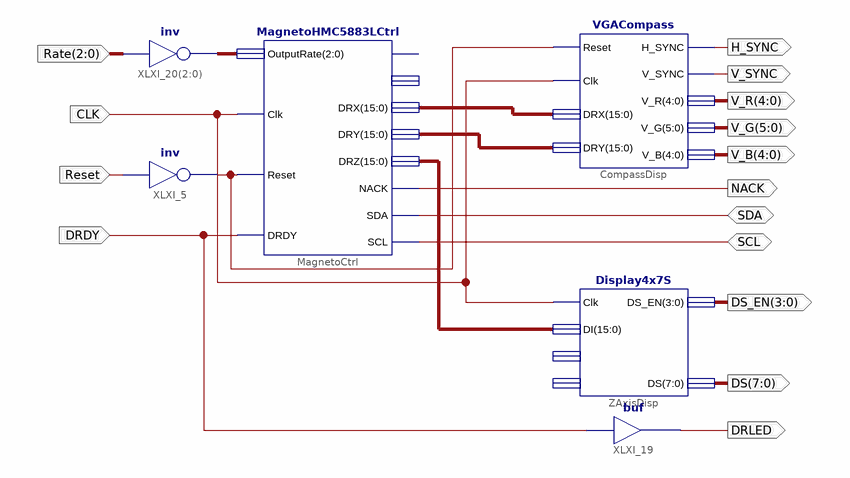
[diagram p0: schematic sheet 1]
// Xilinx ISE schematic magneto_i2c.sch (spartan6) as structural Verilog: 6 symbols, 15 ports
module magneto_i2c (
  input  CLK,
  input  Reset,
  input  DRDY,
  input  [2:0] Rate,
  inout  SCL,
  inout  SDA,
  output DRLED,
  output [7:0] DS,
  output [3:0] DS_EN,
  output H_SYNC,
  output V_SYNC,
  output [4:0] V_R,
  output [5:0] V_G,
  output [4:0] V_B,
  output NACK
);

  wire XLXN_264;
  wire [2:0] XLXN_94;
  wire [15:0] XLXN_110, XLXN_111, XLXN_278;

  assign XLXN_94 = ~Rate;  // inv XLXI_20[2..0], 3 bits wide
  buf XLXI_19 (DRLED, DRDY);
  Display4x7S ZAxisDisp (.Clk(CLK), .DI(XLXN_278), .DS_EN(DS_EN), .DS(DS));  // open: DP, Blank
  MagnetoHMC5883LCtrl MagnetoCtrl (
    .OutputRate(XLXN_94), .Clk(CLK), .Reset(XLXN_264), .DRDY(DRDY), .DRX(XLXN_110), .DRY(XLXN_111),
    .DRZ(XLXN_278), .NACK(NACK), .SDA(SDA), .SCL(SCL));  // open: DR_New, ID
  not XLXI_5 (XLXN_264, Reset);
  VGACompass CompassDisp (
    .Reset(XLXN_264), .Clk(CLK), .DRX(XLXN_110), .DRY(XLXN_111), .H_SYNC(H_SYNC), .V_SYNC(V_SYNC), .V_R(V_R),
    .V_G(V_G), .V_B(V_B));
endmodule
